# EAGLE design NixieClock (EAGLE 6.3)
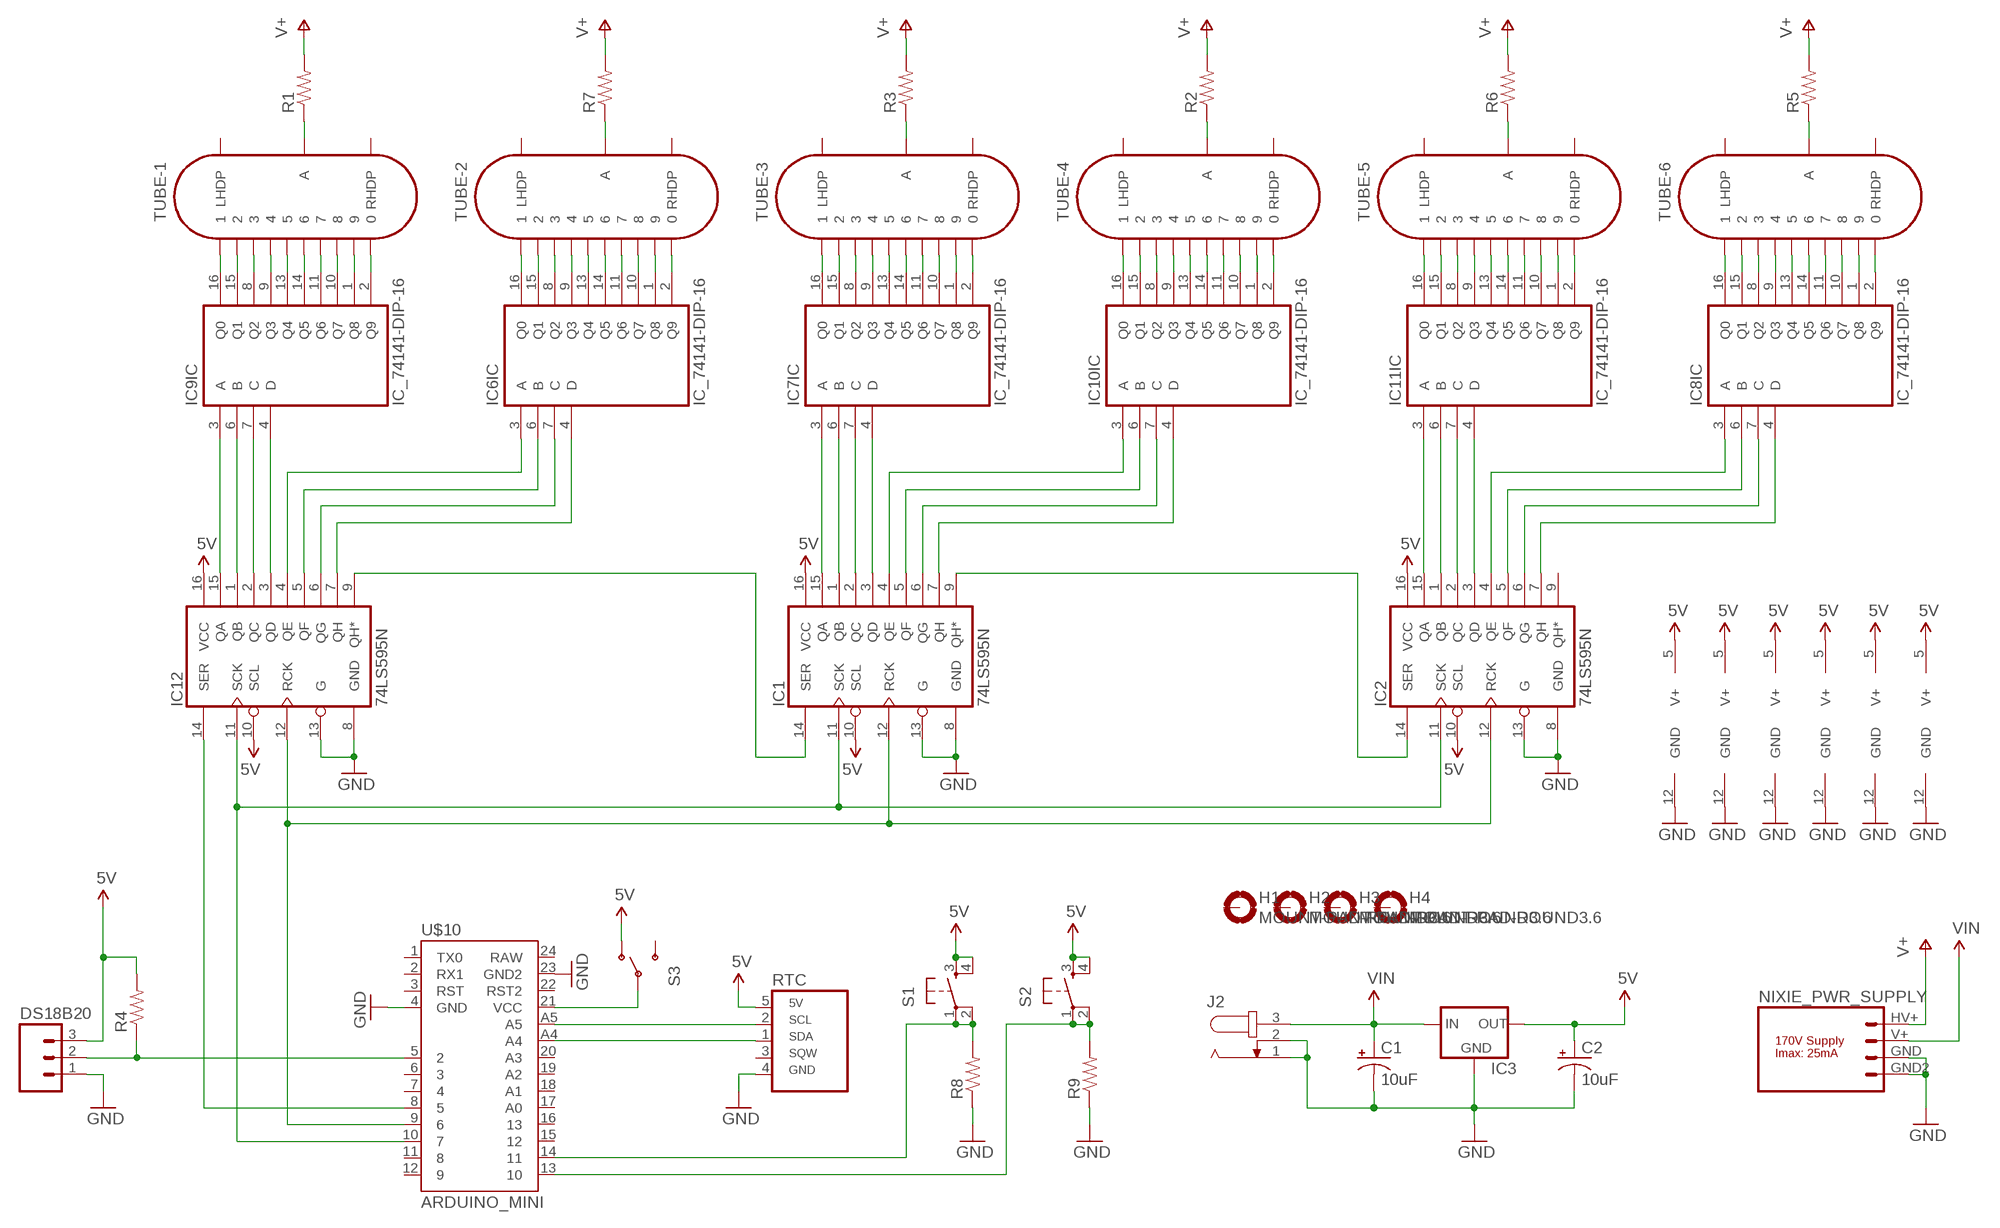
[diagram p0: schematic, sheet 1]

## Parts
C1  10uF  CAP_POLPTH2  [CPOL-RADIAL-10UF-25V]
C2  10uF  CAP_POLPTH2  [CPOL-RADIAL-10UF-25V]
DS18B20  DS18B20DS18B20  [DS18B20]
H1  MOUNT-PAD-ROUND3.6  [3,6-PAD]
H2  MOUNT-PAD-ROUND3.6  [3,6-PAD]
H3  MOUNT-PAD-ROUND3.6  [3,6-PAD]
H4  MOUNT-PAD-ROUND3.6  [3,6-PAD]
IC1  74LS595N  [DIL16]
IC2  74LS595N  [DIL16]
IC3  V_REG_78XXSIDE  [78XXL]
IC6  IC_74141-DIP-16  [DIL16]
IC7  IC_74141-DIP-16  [DIL16]
IC8  IC_74141-DIP-16  [DIL16]
IC9  IC_74141-DIP-16  [DIL16]
IC10  IC_74141-DIP-16  [DIL16]
IC11  IC_74141-DIP-16  [DIL16]
IC12  74LS595N  [DIL16]
J2  JACK-PLUG0  [SPC4077]
NIXIE_PWR_SUPPLY  NIXIE_PWR_SUPPLYPTH  [NIXIE_PWR_SUPPLY]
R1  RESISTORPTH-1/4W  [AXIAL-0.4]
R2  RESISTORPTH-1/4W  [AXIAL-0.4]
R3  RESISTORPTH-1/4W  [AXIAL-0.4]
R4  RESISTORPTH-1/4W  [AXIAL-0.4]
R5  RESISTORPTH-1/4W  [AXIAL-0.4]
R6  RESISTORPTH-1/4W  [AXIAL-0.4]
R7  RESISTORPTH-1/4W  [AXIAL-0.4]
R8  RESISTORPTH-1/4W  [AXIAL-0.4]
R9  RESISTORPTH-1/4W  [AXIAL-0.4]
RTC  SCOTT_RTCPTH  [SCOTT_RTC]
S1  TAC_SWITCHPTH  [TACTILE-PTH]
S2  TAC_SWITCHPTH  [TACTILE-PTH]
S3  SWITCH-SPDTPTH  [SWITCH-SPDT]
TUBE-1  IN-14  [IN-14]
TUBE-2  IN-14  [IN-14]
TUBE-3  IN-14  [IN-14]
TUBE-4  IN-14  [IN-14]
TUBE-5  IN-14  [IN-14]
TUBE-6  IN-14  [IN-14]
U$10  ARDUINO_MINI  [ARDUINO_MINI]

## Nets
5V: C2.1(+) DS18B20.3(5V) IC1.10(SCL) IC1.16(VCC) IC2.10(SCL) IC2.16(VCC) IC3.OUT IC6.5(SUPPLY:V+) IC7.5(SUPPLY:V+) IC8.5(SUPPLY:V+) IC9.5(SUPPLY:V+) IC10.5(SUPPLY:V+) IC11.5(SUPPLY:V+) IC12.10(SCL) IC12.16(VCC) R4.P$2 RTC.5(5V) S1.3 S1.4 S2.3 S2.4 S3.1(O)
GND: C1.2(-) C2.2(-) DS18B20.1(GND) IC1.8(GND) IC1.13(G) IC2.8(GND) IC2.13(G) IC3.GND IC6.12(SUPPLY:GND) IC7.12(SUPPLY:GND) IC8.12(SUPPLY:GND) IC9.12(SUPPLY:GND) IC10.12(SUPPLY:GND) IC11.12(SUPPLY:GND) IC12.8(GND) IC12.13(G) J2.1 J2.2 NIXIE_PWR_SUPPLY.GND NIXIE_PWR_SUPPLY.GND2 R8.P$1 R9.P$1 RTC.4(GND) U$10.4(GND) U$10.23(GND2)
N$1 [High Voltage 170V]: R1.P$1 TUBE-1.A
N$2 [High Voltage 170V]: R7.P$1 TUBE-2.A
N$3 [High Voltage 170V]: R3.P$1 TUBE-3.A
N$4 [High Voltage 170V]: R2.P$1 TUBE-4.A
N$5 [High Voltage 170V]: R6.P$1 TUBE-5.A
N$6 [High Voltage 170V]: R5.P$1 TUBE-6.A
N$7: IC9.16(IC:Q0) TUBE-1.1
N$8 [High Voltage 60V]: IC9.15(IC:Q1) TUBE-1.2
N$9 [High Voltage 60V]: IC9.8(IC:Q2) TUBE-1.3
N$10 [High Voltage 60V]: IC9.9(IC:Q3) TUBE-1.4
N$11 [High Voltage 60V]: IC9.13(IC:Q4) TUBE-1.5
N$12 [High Voltage 60V]: IC9.14(IC:Q5) TUBE-1.6
N$13 [High Voltage 60V]: IC9.11(IC:Q6) TUBE-1.7
N$14 [High Voltage 60V]: IC9.10(IC:Q7) TUBE-1.8
N$15 [High Voltage 60V]: IC9.1(IC:Q8) TUBE-1.9
N$16 [High Voltage 60V]: IC9.2(IC:Q9) TUBE-1.0
N$17 [High Voltage 60V]: IC6.16(IC:Q0) TUBE-2.1
N$18 [High Voltage 60V]: IC6.15(IC:Q1) TUBE-2.2
N$19 [High Voltage 60V]: IC6.8(IC:Q2) TUBE-2.3
N$20 [High Voltage 60V]: IC6.9(IC:Q3) TUBE-2.4
N$21 [High Voltage 60V]: IC6.13(IC:Q4) TUBE-2.5
N$22 [High Voltage 60V]: IC6.14(IC:Q5) TUBE-2.6
N$23 [High Voltage 60V]: IC6.11(IC:Q6) TUBE-2.7
N$24 [High Voltage 60V]: IC6.10(IC:Q7) TUBE-2.8
N$25 [High Voltage 60V]: IC6.1(IC:Q8) TUBE-2.9
N$26 [High Voltage 60V]: IC6.2(IC:Q9) TUBE-2.0
N$27 [High Voltage 60V]: IC7.16(IC:Q0) TUBE-3.1
N$28 [High Voltage 60V]: IC7.15(IC:Q1) TUBE-3.2
N$29 [High Voltage 60V]: IC7.8(IC:Q2) TUBE-3.3
N$30 [High Voltage 60V]: IC7.9(IC:Q3) TUBE-3.4
N$31 [High Voltage 60V]: IC7.13(IC:Q4) TUBE-3.5
N$32 [High Voltage 60V]: IC7.14(IC:Q5) TUBE-3.6
N$33 [High Voltage 60V]: IC7.11(IC:Q6) TUBE-3.7
N$34 [High Voltage 60V]: IC7.10(IC:Q7) TUBE-3.8
N$35 [High Voltage 60V]: IC7.1(IC:Q8) TUBE-3.9
N$36 [High Voltage 60V]: IC7.2(IC:Q9) TUBE-3.0
N$37 [High Voltage 60V]: IC10.16(IC:Q0) TUBE-4.1
N$38 [High Voltage 60V]: IC10.15(IC:Q1) TUBE-4.2
N$39 [High Voltage 60V]: IC10.8(IC:Q2) TUBE-4.3
N$40 [High Voltage 60V]: IC10.9(IC:Q3) TUBE-4.4
N$41 [High Voltage 60V]: IC10.13(IC:Q4) TUBE-4.5
N$42 [High Voltage 60V]: IC10.14(IC:Q5) TUBE-4.6
N$43 [High Voltage 60V]: IC10.11(IC:Q6) TUBE-4.7
N$44 [High Voltage 60V]: IC10.10(IC:Q7) TUBE-4.8
N$45 [High Voltage 60V]: IC10.1(IC:Q8) TUBE-4.9
N$46 [High Voltage 60V]: IC10.2(IC:Q9) TUBE-4.0
N$47 [High Voltage 60V]: IC11.16(IC:Q0) TUBE-5.1
N$48 [High Voltage 60V]: IC11.15(IC:Q1) TUBE-5.2
N$49 [High Voltage 60V]: IC11.8(IC:Q2) TUBE-5.3
N$50 [High Voltage 60V]: IC11.9(IC:Q3) TUBE-5.4
N$51 [High Voltage 60V]: IC11.13(IC:Q4) TUBE-5.5
N$52 [High Voltage 60V]: IC11.14(IC:Q5) TUBE-5.6
N$53 [High Voltage 60V]: IC11.11(IC:Q6) TUBE-5.7
N$54 [High Voltage 60V]: IC11.10(IC:Q7) TUBE-5.8
N$55 [High Voltage 60V]: IC11.1(IC:Q8) TUBE-5.9
N$56 [High Voltage 60V]: IC11.2(IC:Q9) TUBE-5.0
N$57 [High Voltage 60V]: IC8.16(IC:Q0) TUBE-6.1
N$58 [High Voltage 60V]: IC8.15(IC:Q1) TUBE-6.2
N$59 [High Voltage 60V]: IC8.8(IC:Q2) TUBE-6.3
N$60 [High Voltage 60V]: IC8.9(IC:Q3) TUBE-6.4
N$61 [High Voltage 60V]: IC8.13(IC:Q4) TUBE-6.5
N$62 [High Voltage 60V]: IC8.14(IC:Q5) TUBE-6.6
N$63 [High Voltage 60V]: IC8.11(IC:Q6) TUBE-6.7
N$64 [High Voltage 60V]: IC8.10(IC:Q7) TUBE-6.8
N$65 [High Voltage 60V]: IC8.1(IC:Q8) TUBE-6.9
N$66 [High Voltage 60V]: IC8.2(IC:Q9) TUBE-6.0
N$67: IC1.1(QB) IC7.6(IC:B)
N$68: IC1.2(QC) IC7.7(IC:C)
N$69: IC1.3(QD) IC7.4(IC:D)
N$70: IC1.15(QA) IC7.3(IC:A)
N$71: IC9.6(IC:B) IC12.1(QB)
N$72: IC9.7(IC:C) IC12.2(QC)
N$73: IC9.4(IC:D) IC12.3(QD)
N$74: IC9.3(IC:A) IC12.15(QA)
N$75: IC2.1(QB) IC11.6(IC:B)
N$76: IC2.2(QC) IC11.7(IC:C)
N$77: IC2.3(QD) IC11.4(IC:D)
N$78: IC2.15(QA) IC11.3(IC:A)
N$79: IC6.3(IC:A) IC12.4(QE)
N$80: IC6.6(IC:B) IC12.5(QF)
N$81: IC6.7(IC:C) IC12.6(QG)
N$82: IC6.4(IC:D) IC12.7(QH)
N$83: IC1.14(SER) IC12.9(QH*)
N$84: IC1.9(QH*) IC2.14(SER)
N$85: IC1.4(QE) IC10.3(IC:A)
N$86: IC1.5(QF) IC10.6(IC:B)
N$87: IC1.6(QG) IC10.7(IC:C)
N$88: IC1.7(QH) IC10.4(IC:D)
N$89: IC12.14(SER) U$10.8
N$90: IC2.4(QE) IC8.3(IC:A)
N$91: IC2.5(QF) IC8.6(IC:B)
N$92: IC2.6(QG) IC8.7(IC:C)
N$93: IC2.7(QH) IC8.4(IC:D)
N$94: IC1.11(SCK) IC2.11(SCK) IC12.11(SCK) U$10.10
N$95: IC1.12(RCK) IC2.12(RCK) IC12.12(RCK) U$10.9
N$96: R9.P$2 S2.1 S2.2 U$10.13
N$97: DS18B20.2(DS) R4.P$1 U$10.5
N$98: RTC.2(SCL) U$10.A5
N$99: RTC.1(SDA) U$10.A4
N$100: S3.2(P) U$10.21(VCC)
N$101: R8.P$2 S1.1 S1.2 U$10.14
V+ [High Voltage 170V]: NIXIE_PWR_SUPPLY.HV+ R1.P$2 R2.P$2 R3.P$2 R5.P$2 R6.P$2 R7.P$2
VIN: C1.1(+) IC3.IN J2.3 NIXIE_PWR_SUPPLY.V+
Unconnected: H1.B3,6(MOUNT) H2.B3,6(MOUNT) H3.B3,6(MOUNT) H4.B3,6(MOUNT) IC2.9(QH*) RTC.3(SQW) S3.3(S) TUBE-1.LHDP TUBE-1.RHDP TUBE-2.LHDP TUBE-2.RHDP TUBE-3.LHDP TUBE-3.RHDP TUBE-4.LHDP TUBE-4.RHDP TUBE-5.LHDP TUBE-5.RHDP TUBE-6.LHDP TUBE-6.RHDP U$10.1(TX0) U$10.2(RX1) U$10.3(RST) U$10.6 U$10.7 U$10.11 U$10.12 U$10.15 U$10.16 U$10.17(A0) U$10.18(A1) U$10.19(A2) U$10.20(A3) U$10.22(RST2) U$10.24(RAW)

## Library data of the parts
C1 C2 = SparkFun-Passives:CAP_POL: Capacitor Polarized These are standard SMD and PTH capacitors. Normally 10uF, 47uF, and 100uF in electrolytic and tantalum varieties. Always verify the external diameter of the through hole cap, it varies with capacity, voltage, and manufacturer. The EIA devices should be standard.
DS18B20 = ScottCustom:DS18B20: Header 3 Standard 3-pin 0.1" header. Use with straight break away headers (SKU : PRT-00116), right angle break away headers (PRT-00553), swiss pins (PRT-00743), machine pins (PRT-00117), and female headers (PRT-00115). Molex polarized connector foot print use with SKU : PRT-08232 with associated crimp pins and housings.
H1-H4 = holes:MOUNT-PAD-ROUND: MOUNTING PAD, round
IC1 IC2 IC12 = SparkFun:74*595: 8-bit SHIFT REGISTER, output latch
IC3 = SparkFun:V_REG_78XX: Voltage Regulator Standard 7805 5V regulator. IGO (Input Ground Output). Spark Fun Electronics SKU : COM-00107
IC6-IC11 = dp_devices:IC_74141: BCD to decimal decoder
J2 = con-jack:JACK-PLUG: DC POWER JACK Power Jack, DC, Right Angle, Through Hole, Rated 5A at 16VDC, PC Terminals Distributor: Farnell (www.Farnell.de) Drawing: 84N1161.pdf / 84N1162.pdf Manufacturer: SPC Technology (www.spctechnology.com) Type: SPC4077 / SPC 4078; OC_FARNELL: unknown; OC_NEWARK: unknown
NIXIE_PWR_SUPPLY = ScottCustom:NIXIE_PWR_SUPPLY: Header 4 Standard 4-pin 0.1" header. Use with straight break away headers (SKU : PRT-00116), right angle break away headers (PRT-00553), swiss pins (PRT-00743), machine pins (PRT-00117), and female headers (PRT-00115). Molex polarized connector foot print use with SKU : PRT-08231 with associated crimp pins and housings. 1MM SMD Version SKU: PRT-10208
R1-R3 R5-R7 = SparkFun:RESISTOR: Resistor Basic schematic elements and footprints for 0603, 1206, and PTH resistors.
R4 R8 R9 = SparkFun-Passives:RESISTOR: Resistor Basic schematic elements and footprints for 0603, 1206, and PTH resistors.
RTC = ScottCustom:SCOTT_RTC: Sparkfun RTC breakout board. 5-pin PTH connector.
S1 S2 = SparkFun-Electromechanical:TAC_SWITCH: Momentary Switch Button commonly used for reset or general input. Spark Fun Electronics SKU : COM-00097 SMT- SWCH-08247
S3 = SparkFun-Electromechanical:SWITCH-SPDT: SPDT Switch Simple slide switch, Spark Fun Electronics SKU : COM-00102 DPDT SMT slide switch, AYZ0202, SWCH-08179
TUBE-1-TUBE-6 = ScottCustom:IN-14: IN-14: medium numeric frontview nixie tube
U$10 = ScottCustom:ARDUINO_MINI: Arduino Pro Mini footprint

## Net classes
0 default: width 0.305 mm, clearance 0.305 mm
1 High Voltage 170V: width 0.61 mm, clearance 0.61 mm
2 High Voltage 60V: width 0.406 mm, clearance 0.406 mm
3 Power GND: width 1.016 mm, clearance 0.406 mm

## Board
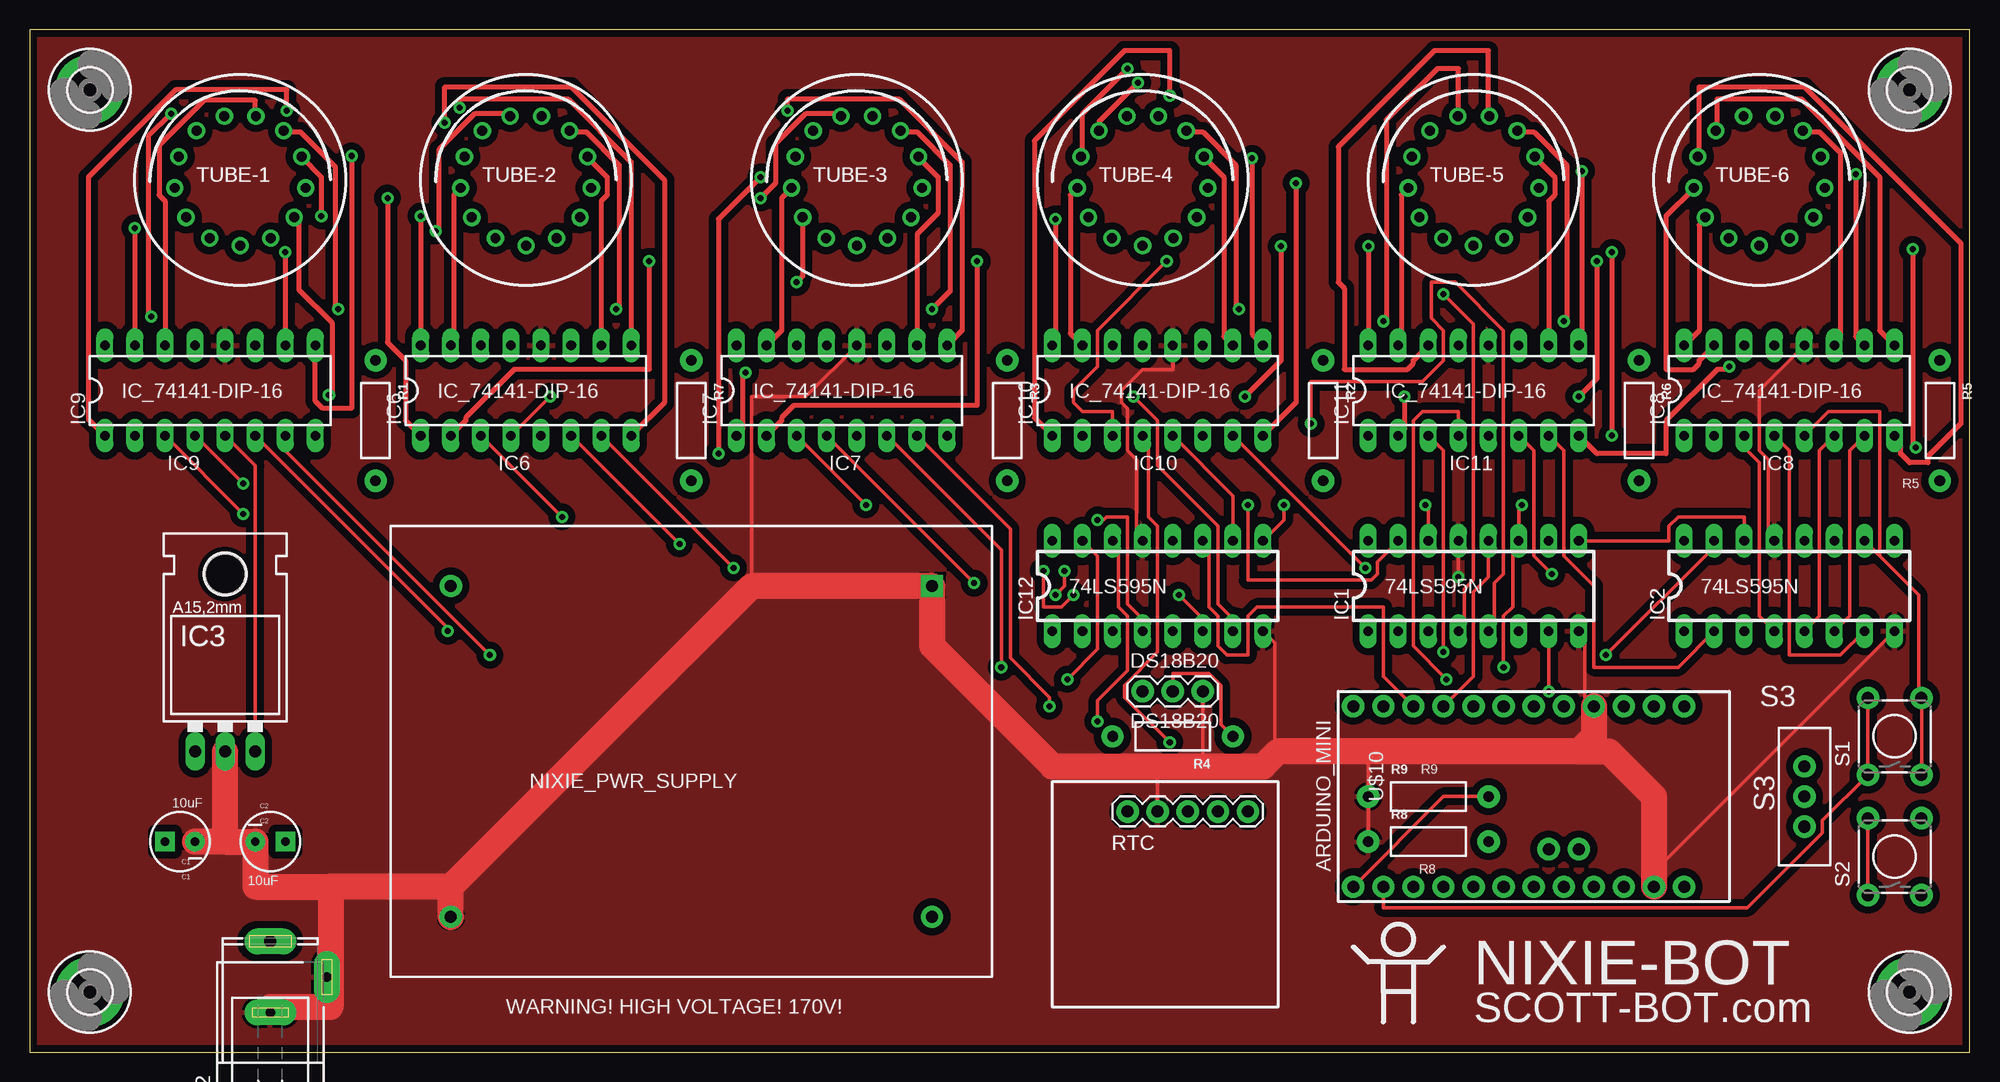
[diagram p1: board, top side]
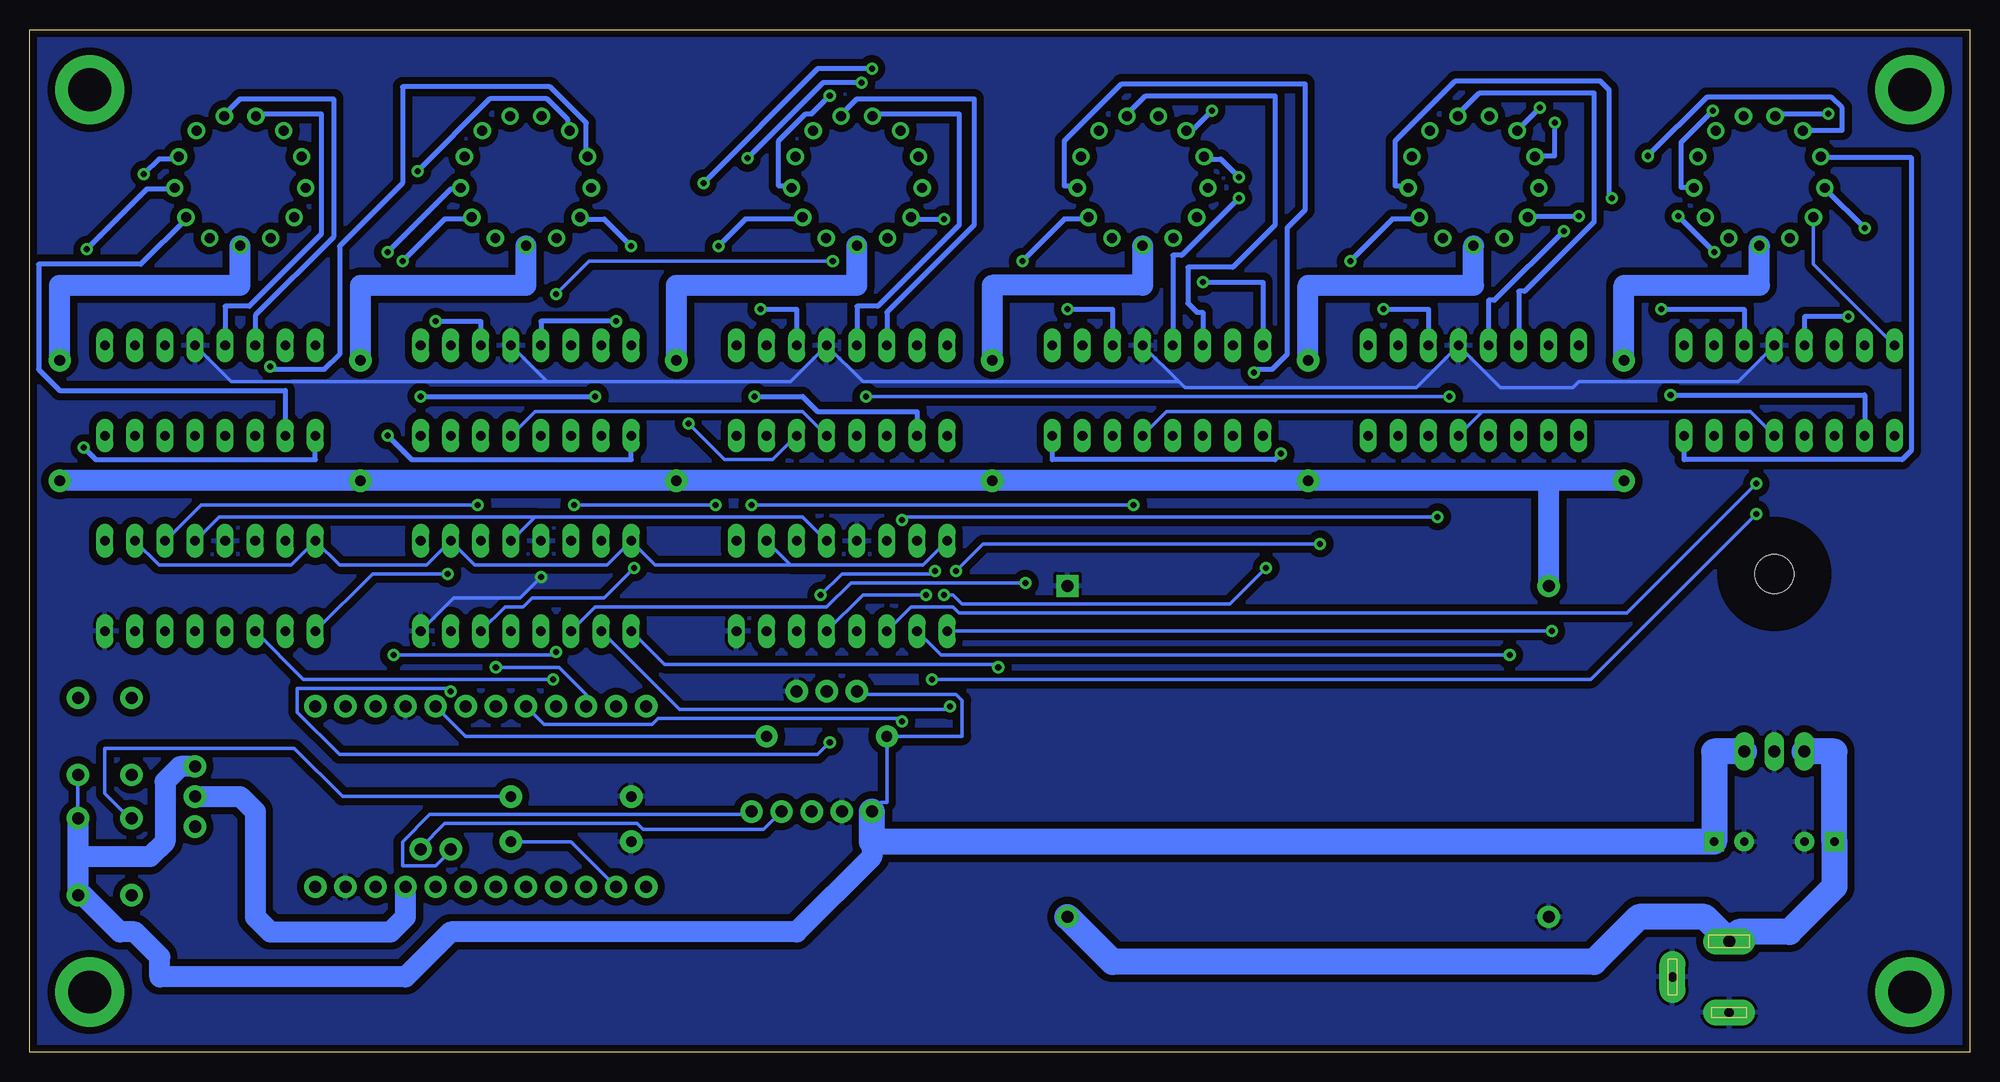
[diagram p2: board, bottom side, seen from below]

Size 163.83 x 86.36 mm. Coordinates in mm from the lower left corner, seen from the top.
Outline: 0,0 163.81,0 163.83,86.36 0,86.36 0,0
Copper layers (1*16): Top 0.035mm / dielectric 1.5mm / Bottom 0.035mm
Design rules "SparkFun": minimum track width 8mil, minimum drill 20mil, track to track 8mil, track to pad 8mil, pad to pad 8mil, via to via 8mil, smd to smd 8mil, copper to edge 10mil, drill to drill 8mil, minimum pad ring 12mil, minimum via ring 10mil, stop-mask expansion 4mil, vias tented up to drill 25mil, thermal gap 10mil

### Footprints (pad centres in the part's own frame; a part is rotated, then mirrored left to right if it is on the bottom)
CPOL-RADIAL-10UF-25V = drill 0.7 pad 1.651 square: 1 1.27,0 | drill 0.7 pad 1.651: 2 -1.27,0
DS18B20 = drill 1.016 pad 1.88: 1 0,0; 2 2.54,0; 3 5.08,0
3,6-PAD = drill 3.6 pad 5.842: B3,6 0,0
DIL16 = drill 0.813 long: 1 -8.89,-3.81; 2 -6.35,-3.81; 3 -3.81,-3.81; 4 -1.27,-3.81; 5 1.27,-3.81; 6 3.81,-3.81; 7 6.35,-3.81; 8 8.89,-3.81; 9 8.89,3.81; 10 6.35,3.81; 11 3.81,3.81; 12 1.27,3.81; 13 -1.27,3.81; 14 -3.81,3.81; 15 -6.35,3.81; 16 -8.89,3.81
78XXL = drill 1.016 long: GND 0,-3.81; IN -2.54,-3.81; OUT 2.54,-3.81 | hole 3.302: 0,11.176
SPC4077 = drill 0.8 pad 2.184 long: 1 -3,0; 2 0,-4.8 | drill 1 pad 2.184 long: 3 3,0
NIXIE_PWR_SUPPLY = drill 1.016 pad 1.88: GND 21.59,17.78; HV+ 21.59,-10.16; V+ -19.05,17.78 | drill 1.016 pad 1.88 square: GND2 -19.05,-10.16
AXIAL-0.4 = drill 0.9 pad 1.88: P$1 -5.08,0; P$2 5.08,0
SCOTT_RTC = drill 1.016 pad 1.88: 1 7.62,7.62; 2 5.08,7.62; 3 2.54,7.62; 4 0,7.62; 5 -2.54,7.62
TACTILE-PTH = drill 1.016 pad 1.88: 1 -3.251,2.261; 2 3.251,2.261; 3 -3.251,-2.261; 4 3.251,-2.261
SWITCH-SPDT = drill 1.016 pad 1.88: 1 0,2.54; 2 0,0; 3 0,-2.54
IN-14 = drill 0.84: 0 4.572,-3.157; 1 -4.572,-3.157; 2 -5.517,-0.671; 3 -5.194,1.971; 4 -3.686,4.158; 5 -1.331,5.395; 6 1.331,5.395; 7 3.686,4.158; 8 5.194,1.971; 9 5.517,-0.671; A 0,-5.558; LHDP 2.583,-4.92; RHDP -2.583,-4.92
ARDUINO_MINI = drill 1.016 pad 1.88: 1 -7.62,12.7; 2 -7.62,10.16; 3 -7.62,7.62; 4 -7.62,5.08; 5 -7.62,2.54; 6 -7.62,0; 7 -7.62,-2.54; 8 -7.62,-5.08; 9 -7.62,-7.62; 10 -7.62,-10.16; 11 -7.62,-12.7; 12 -7.62,-15.24; 13 7.62,-15.24; 14 7.62,-12.7; 15 7.62,-10.16; 16 7.62,-7.62; 17 7.62,-5.08; 18 7.62,-2.54; 19 7.62,0; 20 7.62,2.54; 21 7.62,5.08; 22 7.62,7.62; 23 7.62,10.16; 24 7.62,12.7; A4 4.445,1.27; A5 4.445,3.81

### Placement (x,y rotation side)
C1  12.7,17.78 180 top
C2  20.32,17.78 0 top
DS18B20  99.06,30.48 180 top
H1  5.08,5.08 0 top
H2  158.75,5.08 0 top
H3  158.75,81.28 0 top
H4  5.08,81.28 0 top
IC1  121.92,39.37 0 top
IC2  148.59,39.37 0 top
IC3  16.51,29.21 0 top
IC6  41.91,55.88 0 top
IC7  68.58,55.88 0 top
IC8  148.59,55.88 0 top
IC9  15.24,55.88 0 top
IC10  95.25,55.88 0 top
IC11  121.92,55.88 0 top
IC12  95.25,39.37 0 top
J2  20.32,6.35 90 top
NIXIE_PWR_SUPPLY  57.15,29.21 180 top
R1  29.21,53.34 270 top
R2  109.22,53.34 270 top
R3  82.55,53.34 270 top
R4  96.52,26.67 180 top
R5  161.29,53.34 270 top
R6  135.89,53.34 270 top
R7  55.88,53.34 270 top
R8  118.11,17.78 0 top
R9  118.11,21.59 0 top
RTC  95.25,12.7 0 top
S1  157.48,26.67 90 top
S2  157.48,16.51 90 top
S3  149.86,21.59 0 top
TUBE-1  17.78,73.66 0 top
TUBE-2  41.91,73.66 0 top
TUBE-3  69.85,73.66 0 top
TUBE-4  93.98,73.66 0 top
TUBE-5  121.92,73.66 0 top
TUBE-6  146.05,73.66 0 top
U$10  127,21.59 270 top

### Tracks (layer width: path | path; a pad name or v marks a point on that pad's centre or on a via)
5V
  Top 0.305: IC10.5 101.6,46.99 IC12.10 | 156.21,41.91 159.51,38.61 159.51,29.97 S1.4 159.77,29.72 159.77,23.62 S1.3 | 156.21,41.91 IC2.10 | IC8.5 151.89,54.1 156.21,54.1 156.21,41.91 | IC9.5 19.05,49.53 IC3.OUT
  Bottom 0.305: IC12.16 88.39,41.15 99.57,41.15 | IC12.10 99.57,41.15 | 99.57,41.15 111,41.15 IC1.16 115.06,41.15 126.24,41.15 IC1.10 130.3,41.15 137.67,41.15 IC2.16 141.73,41.15 152.91,41.15 IC2.10 | IC11.5 121.16,54.1 98.55,54.1 IC10.5 | 41.15,54.1 IC6.5 | 41.15,54.1 18.54,54.1 IC9.5 | IC7.5 67.82,54.1 41.15,54.1 | RTC.5 91.95,21.08 91.44,21.08 R4.P$2 85.09,26.67 85.09,29.72 85.6,30.23 93.73,30.23 DS18B20.3 | S1.3 159.77,23.37 159.77,20.57 S2.4
  Bottom 1.778: RTC.5 92.71,16.51 99.06,10.16 128.27,10.16 132.08,6.35 152.83,6.35 152.83,8.05 154.94,10.16 156.21,10.16 159.31,13.26 S2.3 159.74,16.51 | 159.74,16.51 S2.4 | S3.1 151.13,24.13 152.4,22.86 152.4,17.78 153.67,16.51 159.74,16.51
  Bottom 2.184: IC3.OUT 21.59,25.4 C2.1 92.71,17.78 RTC.5
GND  (via drill 0.51)
  Top 0.305: IC2.13 146.81,43.69 146.81,50.04 146.05,50.8 146.05,55.88 IC8.12 | IC12.13 93.47,43.69 93.47,50.04 92.71,50.8 92.71,54.36 92.2,54.86 92.2,55.88 93.98,57.66 96.52,57.66 IC10.12 | R8.P$1 R9.P$1 113.03,25.4 | IC12.8 105.16,34.54 105.16,26.42 105.41,25.4 | IC1.8 131.32,35.05 131.32,29.97 U$10.4 | v120.65,40.13 IC1.13 | IC2.8 138.18,16.26 137.16,16.26 | IC7.12 65.53,55.37 60.96,55.37 60.96,39.37 | 95.25,24.13 RTC.4 | 99.06,24.13 DS18B20.1 | 20.32,3.3 J2.1 20.32,3.81 | J2.2 25.4,6.35
  Top 2.184: 25.4,13.97 19.05,13.97 C2.2 16.51,17.78 | 25.4,13.97 25.4,6.35 25.4,3.81 20.32,3.81 | 16.51,17.78 IC3.GND | NIXIE_PWR_SUPPLY.GND 35.56,13.97 | 35.56,13.97 25.4,13.97 | 35.56,13.97 60.96,39.37 NIXIE_PWR_SUPPLY.GND2 76.2,34.29 86.36,24.13 95.25,24.13 99.06,24.13 104.14,24.13 105.41,25.4 113.03,25.4 130.81,25.4 | U$10.4 132.08,26.67 130.81,25.4 | 130.81,25.4 133.35,25.4 137.16,21.59 137.16,16.26 U$10.23 | 16.51,17.78 C1.2
  Bottom 0.305: 120.14,56.64 IC11.12 | 120.14,56.64 99.57,56.64 IC10.12 93.47,56.64 66.8,56.64 | IC8.12 146.81,56.64 120.14,56.64 | IC9.12 19.56,56.64 33.02,56.64 33.53,56.13 39.62,56.13 IC6.12 46.74,56.13 66.29,56.13 66.8,56.64 | v120.65,40.13 122.43,38.35 128.02,38.35 IC1.8 | IC7.12 66.8,56.64
  pour Bottom (isolate 0.61): 0,86.36 163.83,86.36 163.83,0 0,0
  pour Top (isolate 0.61): 0,86.36 163.83,86.36 163.83,0 0,0
N$1
  Bottom 1.778: R1.P$1 29.21,64.77 17.78,64.77 TUBE-1.A
N$2
  Bottom 1.778: R7.P$1 55.88,64.77 41.91,64.77 TUBE-2.A
N$3
  Bottom 1.778: TUBE-3.A 69.85,64.77 82.55,64.77 R3.P$1
N$4
  Bottom 1.778: R2.P$1 109.22,64.77 93.98,64.77 TUBE-4.A
N$5
  Bottom 1.778: R6.P$1 135.89,64.77 121.92,64.77 TUBE-5.A
N$6
  Bottom 1.778: R5.P$1 161.29,64.77 146.05,64.77 TUBE-6.A
N$7
  Bottom 0.305: IC9.16 13.21,66.55 TUBE-1.1
N$8  (via drill 0.51)
  Top 0.406: v8.89,69.6 IC9.15
  Bottom 0.406: v8.89,69.6 12.19,72.9 TUBE-1.2
N$9
  Bottom 0.406: IC9.8 24.13,50.04 5.71,50.04 4.95,50.8 4.95,75.56 12.57,75.56 TUBE-1.3
N$10  (via drill 0.51)
  Top 0.406: IC9.9 24.13,54.99 24.77,54.36 27.18,54.36 v27.18,75.69
  Bottom 0.406: v27.18,75.69 22.23,80.64 11.68,80.64 10.79,79.76 10.79,77.85 13.97,77.85 TUBE-1.4
N$11  (via drill 0.51)
  Top 0.406: v10.29,62.1 10.03,62.36 10.03,77.34 v11.94,79.25
  Bottom 0.406: IC9.13 13.97,62.1 v10.29,62.1 | v11.94,79.25 16.26,79.25 TUBE-1.5
N$12
  Top 0.406: IC9.14 11.43,71.88 10.92,72.39 10.92,76.58 14.73,80.39 19.05,80.39 19.05,79.12 TUBE-1.6
N$13  (via drill 0.51)
  Top 0.406: v26.04,62.74 25.78,62.99 25.78,74.8 22.86,77.72 21.59,77.72 TUBE-1.7
  Bottom 0.406: IC9.11 19.05,62.74 v26.04,62.74
N$14  (via drill 0.51)
  Top 0.406: v21.59,67.56 IC9.10 | v24.64,70.61 24.64,73.91 22.99,75.56 TUBE-1.8
  Bottom 0.406: v24.64,70.61 v21.59,67.56
N$15  (via drill 0.51)
  Top 0.406: IC9.1 4.95,53.47 4.95,73.91 12.32,81.28 21.72,81.28 v21.72,79.5
  Bottom 0.406: v21.72,79.5 24.38,76.83 24.38,73.03 23.37,73.03 TUBE-1.9
N$16  (via drill 0.51)
  Top 0.406: v25.27,55.5 25.53,55.75 25.53,61.59 22.73,64.39 22.73,70.1 22.35,70.48 TUBE-1.0
  Bottom 0.406: IC9.2 8.89,55.5 v25.27,55.5
N$17  (via drill 0.51)
  Top 0.406: v33.02,70.61 IC6.16
  Bottom 0.406: v33.02,70.61 37.34,70.61 TUBE-2.1
N$18
  Top 0.406: IC6.15 35.81,59.94 35.81,72.39 36.32,72.9 TUBE-2.2
N$19  (via drill 0.51)
  Top 0.406: IC6.8 53.59,54.86 53.59,73.66 45.72,81.53 35.05,81.53 v35.05,78.49
  Bottom 0.406: v35.05,78.49 35.05,75.69 36.58,75.69 TUBE-2.3
N$20  (via drill 0.51)
  Top 0.406: IC6.9 50.8,75.18 45.47,80.52 36.32,80.52 v36.32,79.76
  Bottom 0.406: v36.32,79.76 38.1,77.98 TUBE-2.4
N$21  (via drill 0.51)
  Top 0.406: v34.29,69.34 34.54,69.6 34.54,76.2 37.59,79.25 40.39,79.25 TUBE-2.5
  Bottom 0.406: IC6.13 40.64,63.5 40.13,63.5 v34.29,69.34
N$22
  Bottom 0.406: IC6.14 38.1,64.26 37.59,64.26 31.75,70.1 31.75,81.03 41.4,81.03 43.18,79.25 TUBE-2.6
N$23  (via drill 0.51)
  Top 0.406: v49.53,62.74 49.78,62.99 49.78,74.93 46.99,77.72 45.72,77.72 TUBE-2.7
  Bottom 0.406: IC6.11 45.72,62.74 v49.53,62.74
N$24
  Top 0.406: IC6.10 48.26,71.88 48.77,72.39 48.77,73.91 47.24,75.44 TUBE-2.8
N$25  (via drill 0.51)
  Top 0.406: v30.23,72.14 30.23,59.94 31.75,58.42 31.75,53.34 IC6.1
  Bottom 0.406: TUBE-2.9 47.5,73.15 48.51,73.15 48.51,76.96 43.43,82.04 31.24,82.04 30.48,81.28 30.48,72.39 v30.23,72.14
N$26  (via drill 0.51)
  Top 0.406: IC6.2 36.83,53.34 36.83,53.59 40.89,57.66 52.32,57.66 v52.32,66.8
  Bottom 0.406: v52.32,66.8 48.77,70.36 46.48,70.36 TUBE-2.0
N$27  (via drill 0.51)
  Top 0.406: v64.77,65.02 65.28,65.53 TUBE-3.1
  Bottom 0.406: IC7.16 59.69,65.02 v64.77,65.02
N$28
  Top 0.406: IC7.15 63.5,60.96 63.5,72.14 64.26,72.9 TUBE-3.2
N$29  (via drill 0.51)
  Top 0.406: v58.17,50.55 58.17,70.36 v61.72,73.91
  Bottom 0.406: IC7.8 77.47,50.04 58.67,50.04 v58.17,50.55 | v61.72,73.91 63.25,75.44 64.52,75.44 TUBE-3.3
N$30  (via drill 0.51)
  Top 0.406: IC7.9 78.74,60.96 78.74,75.18 73.41,80.52 64.01,80.52 v64.01,79.5
  Bottom 0.406: v64.01,79.5 65.53,77.98 66.04,77.98 TUBE-3.4
N$31  (via drill 0.51)
  Top 0.406: v61.72,72.14 62.99,73.41 62.99,76.71 65.53,79.25 68.33,79.25 TUBE-3.5
  Bottom 0.406: IC7.13 67.31,67.31 66.55,67.31 v61.72,72.14
N$32
  Bottom 0.406: IC7.14 64.77,62.48 65.28,62.48 66.04,63.25 66.04,66.29 62.23,66.29 58.67,69.85 58.67,80.77 69.6,80.77 71.12,79.25 TUBE-3.6
N$33  (via drill 0.51)
  Top 0.406: v76.2,62.74 77.72,64.26 77.72,74.93 74.93,77.72 73.66,77.72 TUBE-3.7
  Bottom 0.406: IC7.11 72.39,62.74 v76.2,62.74
N$34
  Top 0.406: IC7.10 74.93,69.09 76.71,70.87 76.71,73.91 75.18,75.44 TUBE-3.8
N$35  (via drill 0.51)
  Top 0.406: IC7.1 60.2,52.58 60.2,57.15 v60.45,57.4
  Bottom 0.406: v60.45,57.4 60.2,57.66 58.93,57.66 57.66,58.93 57.66,69.6 56.13,71.12 56.13,81.79 71.63,81.79 76.45,76.96 76.45,73.15 75.44,73.15 TUBE-3.9
N$36  (via drill 0.51)
  Top 0.406: IC7.2 63.5,53.34 63.5,53.59 64.52,54.61 80.01,54.61 v80.01,66.8
  Bottom 0.406: v80.01,66.8 76.45,70.36 74.42,70.36 TUBE-3.0
N$37  (via drill 0.51)
  Top 0.406: IC10.16 86.61,59.94 v86.61,70.36
  Bottom 0.406: v86.61,70.36 89.41,70.36 TUBE-4.1
N$38
  Top 0.406: IC10.15 87.88,60.71 87.88,72.39 88.39,72.9 TUBE-4.2
N$39  (via drill 0.51)
  Top 0.406: IC10.8 106.93,54.86 v106.93,73.41 | v92.71,83.06 88.9,79.25 88.9,75.69 TUBE-4.3
  Bottom 0.406: v106.93,73.41 97.28,83.06 v92.71,83.06
N$40  (via drill 0.51)
  Top 0.406: v103.23,75.49 103.23,60.66 104.14,59.74 IC10.9 | v93.57,81.89 90.32,78.64 90.32,77.83 TUBE-4.4
  Bottom 0.406: v103.23,75.49 96.83,81.89 v93.57,81.89
N$41
  Bottom 0.406: IC10.13 93.98,62.99 92.2,62.99 85.34,69.85 85.34,79.25 92.46,79.25 TUBE-4.5
N$42
  Bottom 0.406: IC10.14 91.44,62.48 84.07,69.85 84.07,80.52 93.98,80.52 95.25,79.25 TUBE-4.6
N$43  (via drill 0.51)
  Top 0.406: v102.11,62.74 101.85,62.99 101.85,74.93 99.06,77.72 97.79,77.72 TUBE-4.7
  Bottom 0.406: IC10.11 99.06,62.74 v102.11,62.74
N$44
  Top 0.406: IC10.10 100.84,60.45 100.84,73.91 99.31,75.44 TUBE-4.8
N$45  (via drill 0.51)
  Top 0.406: IC10.1 84.84,53.59 84.84,76.96 92.46,84.58 96.27,84.58 v96.27,80.77
  Bottom 0.406: v96.27,80.77 97.79,79.25 98.3,79.25 100.58,76.96 100.58,73.15 99.57,73.15 TUBE-4.9
N$46  (via drill 0.51)
  Top 0.406: v102.62,55.37 105.66,58.42 v105.66,68.07
  Bottom 0.406: IC10.2 88.9,54.1 97.28,54.1 98.55,55.37 v102.62,55.37 | v105.66,68.07 103.38,70.36 98.55,70.36 TUBE-4.0
N$47  (via drill 0.51)
  Top 0.406: v113.03,68.07 IC11.16
  Bottom 0.406: v113.03,68.07 115.32,70.36 117.35,70.36 TUBE-5.1
N$48
  Top 0.406: IC11.15 115.82,59.94 115.82,72.39 116.33,72.9 TUBE-5.2
N$49  (via drill 0.51)
  Top 0.406: IC11.8 132.33,50.55 138.18,50.55 138.18,53.34 142.49,57.66 143.51,57.66 v143.51,57.91
  Bottom 0.406: v143.51,57.91 143.26,57.66 138.94,57.66 137.67,58.93 137.67,68.07 132.33,73.41 132.33,81.53 119.89,81.53 116.84,78.49 116.84,75.69 TUBE-5.3
N$50  (via drill 0.51)
  Top 0.406: IC11.9 131.06,59.94 v131.06,74.42
  Bottom 0.406: v131.06,74.42 124.97,80.52 120.14,80.52 118.36,78.74 118.36,77.98 TUBE-5.4
N$51  (via drill 0.51)
  Top 0.406: v114.3,61.72 114.55,61.98 114.55,78.74 118.87,83.06 120.65,83.06 120.65,79.25 TUBE-5.5
  Bottom 0.406: IC11.13 120.65,61.72 v114.3,61.72
N$52
  Top 0.406: IC11.14 116.84,58.42 116.84,58.17 116.33,57.66 111,57.66 111,64.52 110.49,65.02 110.49,76.45 118.62,84.58 123.19,84.58 123.19,79.25 TUBE-5.6
N$53  (via drill 0.51)
  Top 0.406: v129.54,61.72 129.79,61.98 129.79,74.93 127,77.72 125.73,77.72 TUBE-5.7
  Bottom 0.406: IC11.11 125.73,61.72 v129.54,61.72
N$54
  Top 0.406: IC11.10 128.27,71.88 128.78,72.39 128.78,73.91 127.25,75.44 TUBE-5.8
N$55  (via drill 0.51)
  Top 0.406: v133.6,67.56 v133.6,52.07
  Bottom 0.406: IC11.1 113.03,50.04 131.57,50.04 v133.6,52.07 | v133.6,67.56 128.27,72.9 127.51,72.9 TUBE-5.9
N$56  (via drill 0.51)
  Top 0.406: IC11.2 116.08,52.58 v116.08,55.37 | v130.81,55.37 132.33,56.9 v132.33,66.8
  Bottom 0.406: v130.81,55.37 v116.08,55.37 | v132.33,66.8 128.78,70.36 126.49,70.36 TUBE-5.0
N$57
  Top 0.406: IC8.16 140.97,60.96 140.97,69.85 141.48,70.36 TUBE-6.1
N$58
  Top 0.406: IC8.15 140.97,58.42 140.97,58.17 140.46,57.66 138.18,57.66 138.18,70.61 140.46,72.9 TUBE-6.2
N$59
  Top 0.406: IC8.8 157.99,51.56 157.99,50.55 158.75,49.78 160.27,49.78 160.27,50.29 163.07,53.09 163.07,68.33 149.86,81.53 140.97,81.53 140.97,75.69 TUBE-6.3
N$60
  Top 0.406: IC8.9 156.21,60.96 156.21,73.91 149.61,80.52 142.49,80.52 142.49,77.98 TUBE-6.4
N$61
  Bottom 0.406: IC8.13 147.32,62.99 145.29,62.99 139.19,69.09 139.19,79.25 144.53,79.25 TUBE-6.5
N$62
  Bottom 0.406: IC8.14 144.78,62.23 138.18,68.83 138.18,80.52 146.05,80.52 147.32,79.25 TUBE-6.6
N$63
  Top 0.406: IC8.11 152.91,60.2 152.91,75.95 151.13,77.72 149.86,77.72 TUBE-6.7
N$64  (via drill 0.51)
  Top 0.406: IC8.10 154.18,60.45 v154.18,74.17
  Bottom 0.406: v154.18,74.17 152.91,75.44 151.38,75.44 TUBE-6.8
N$65  (via drill 0.51)
  Top 0.406: v159.26,51.05 159,51.31 v159,67.82
  Bottom 0.406: IC8.1 139.7,50.04 158.24,50.04 v159.26,51.05 | v159,67.82 153.92,72.9 151.64,72.9 TUBE-6.9
N$66
  Bottom 0.406: IC8.2 142.24,55.88 161.29,55.88 163.07,57.66 163.07,66.55 154.43,66.55 150.62,70.36 TUBE-6.0
N$67  (via drill 0.51)
  Top 0.305: IC7.6 82.04,42.42 v82.04,32.51
  Bottom 0.305: v82.04,32.51 82.3,32.77 110.24,32.77 IC1.1
N$68  (via drill 0.51)
  Top 0.305: IC7.7 82.8,44.2 82.8,33.27 86.11,29.97 v86.11,29.21
  Bottom 0.305: v86.11,29.21 86.36,28.96 108.97,28.96 IC1.2
N$69  (via drill 0.51)
  Top 0.305: v79.76,39.62 IC7.4
  Bottom 0.305: v79.76,39.62 94.49,39.62 96.52,37.59 116.08,37.59 IC1.3
N$70  (via drill 0.51)
  Top 0.305: IC1.15 113.79,41.4 113.79,40.39 113.28,39.88 102.87,39.88 v102.87,46.23 | IC7.3 v70.61,46.23
  Bottom 0.305: v70.61,46.23 v102.87,46.23
N$71  (via drill 0.51)
  Top 0.305: IC9.6 35.31,35.81 v35.31,35.56
  Bottom 0.305: IC12.1 v35.31,35.56
N$72  (via drill 0.51)
  Top 0.305: v38.86,33.53 21.59,50.8 IC9.7
  Bottom 0.305: v38.86,33.53 86.87,33.53 IC12.2
N$73  (via drill 0.51)
  Top 0.305: v18.03,48.01 IC9.4
  Bottom 0.305: v18.03,48.01 28.96,37.08 85.34,37.08 85.85,37.59 89.41,37.59 IC12.3
N$74  (via drill 0.51)
  Top 0.305: v18.03,45.47 IC9.3 | v87.63,31.5 90.17,34.04 90.17,41.91 IC12.15
  Bottom 0.305: v18.03,45.47 32,31.5 v87.63,31.5
N$75  (via drill 0.51)
  Top 0.305: v128.52,40.39 127,41.91 127,50.8 IC11.6
  Bottom 0.305: IC2.1 134.87,40.39 v128.52,40.39
N$76
  Top 0.305: IC2.2 139.19,32.51 132.08,32.51 132.08,39.37 129.54,41.91 129.54,50.8 IC11.7
N$77  (via drill 0.51)
  Top 0.305: v119.63,31.5 116.84,34.29 116.84,53.34 117.6,54.1 120.65,54.1 IC11.4
  Bottom 0.305: IC2.3 140.72,31.5 v119.63,31.5
N$78  (via drill 0.51)
  Top 0.305: IC11.3 119.38,50.8 v119.38,33.78 | v133.1,33.53 142.24,42.67 IC2.15
  Bottom 0.305: v119.38,33.78 119.63,33.53 v133.1,33.53
N$79  (via drill 0.51)
  Top 0.305: v44.96,45.21 IC6.3 | v90.17,44.96 90.68,44.96 90.93,45.21 92.71,45.21 92.71,37.85 93.98,36.58 IC12.4
  Bottom 0.305: v44.96,45.21 89.92,45.21 v90.17,44.96
N$80  (via drill 0.51)
  Top 0.305: v88.14,38.61 87.12,37.59 85.6,37.59 v85.6,40.64 | IC6.6 v54.86,42.93
  Bottom 0.305: IC12.5 93.47,38.61 v88.14,38.61 | v85.6,40.64 83.31,42.93 v54.86,42.93
N$81  (via drill 0.51)
  Top 0.305: v59.44,40.89 IC6.7 | v86.61,38.61 87.38,39.37 v87.38,40.64 | v97.03,38.61 99.06,36.58 IC12.6
  Bottom 0.305: v59.44,40.89 62.48,37.85 85.09,37.85 85.85,38.61 v86.61,38.61 | v87.38,40.64 87.63,40.39 95.25,40.39 v97.03,38.61
N$82  (via drill 0.51)
  Top 0.305: v43.94,55.37 IC6.4 | v93.22,55.37 95.25,53.34 95.25,49.53 100.33,44.45 100.33,37.85 101.6,36.58 IC12.7
  Bottom 0.305: v93.22,55.37 v43.94,55.37
N$83  (via drill 0.51)
  Top 0.305: IC12.9 105.92,44.96 v105.92,46.23 | v117.86,46.23 118.11,45.97 IC1.14
  Bottom 0.305: v117.86,46.23 v105.92,46.23
N$84
  Top 0.305: IC1.9 138.43,43.18 138.43,44.45 139.19,45.21 144.78,45.21 IC2.14
N$85  (via drill 0.51)
  Top 0.305: IC1.4 121.16,36.07 121.16,39.12 121.92,39.88 121.92,61.47 v119.38,64.01 | v96.01,66.8 90.17,60.96 90.17,57.91 88.14,55.88 88.14,54.86 88.9,54.1 91.44,54.1 IC10.3
  Bottom 0.305: v119.38,64.01 116.59,66.8 v96.01,66.8
N$86  (via drill 0.51)
  Top 0.305: IC1.5 123.7,36.07 123.7,39.62 124.46,40.39 124.46,60.96 120.4,65.02 118.36,65.02 118.36,61.98 119.38,60.96 119.38,58.42 117.6,56.64 108.2,56.64 v108.2,53.09
  Bottom 0.305: v108.2,53.09 105.16,50.04 101.09,50.04 IC10.6
N$87  (via drill 0.51)
  Top 0.305: v112.78,40.89 IC10.7
  Bottom 0.305: v112.78,40.89 115.32,38.35 121.41,38.35 122.17,37.59 123.7,37.59 IC1.6
N$88  (via drill 0.51)
  Top 0.305: IC10.4 94.49,51.56 94.49,45.21 95.25,44.45 95.25,33.78 92.46,30.99 92.46,29.97 v96.27,26.16 | IC1.7 v128.27,30.48
  Bottom 0.305: v96.27,26.16 97.28,25.15 137.67,25.15 141.22,28.7 141.22,30.73 128.52,30.73 v128.27,30.48
N$89  (via drill 0.51)
  Top 0.305: IC12.14 91.95,42.67 91.95,37.59 92.71,36.83 92.71,32.26 90.17,29.72 v90.17,27.94
  Bottom 0.305: v90.17,27.94 90.42,28.19 110.74,28.19 111.25,27.69 120.4,27.69 U$10.8
N$90
  Top 0.305: IC2.4 146.05,36.83 146.05,49.78 144.78,51.05 IC8.3
N$91
  Top 0.305: IC2.5 151.13,36.83 151.13,50.8 IC8.6
N$92
  Top 0.305: IC2.6 153.67,36.83 153.67,50.8 IC8.7
N$93
  Top 0.305: IC2.7 152.91,33.53 148.59,33.53 148.59,50.8 IC8.4
N$94  (via drill 0.51)
  Top 0.305: IC12.11 99.57,42.67 99.57,37.59 100.33,36.83 100.33,34.29 101.09,33.53 102.87,33.53 102.87,36.83 103.63,37.59 114.3,37.59 114.3,31.75 U$10.10 | v124.46,32.51 124.46,36.83 125.22,37.59 125.22,42.67 IC1.11 125.73,45.97 v125.98,46.23
  Bottom 0.305: v124.46,32.51 119.13,32.51 116.84,30.23 U$10.10 | IC2.11 149.35,46.23 v125.98,46.23
N$95
  Top 0.305: U$10.9 121.92,31.75 121.92,38.86 123.19,40.13 IC1.12
  Bottom 0.305: IC12.12 98.55,45.21 121.16,45.21 | IC1.12 121.16,45.21 | IC2.12 147.83,45.21 121.16,45.21
N$96
  Top 0.305: S2.1 155.19,13.46 155.19,19.56 S2.2 | U$10.13 119.38,21.59 R9.P$2
  Bottom 0.305: R9.P$2 137.41,21.59 141.48,25.65 157.48,25.65 157.48,21.84 155.45,19.81 S2.2
N$97
  Top 0.305: R4.P$1 100.58,27.69 100.58,30.99 99.57,32 96.52,32 DS18B20.2
  Bottom 0.305: U$10.5 127,26.67 R4.P$1
N$98
  Bottom 0.305: RTC.2 101.85,18.8 112.01,18.8 112.52,19.3 128.78,19.3 130.81,17.27 U$10.A5
N$99
  Bottom 0.305: RTC.1 103.12,20.07 130.05,20.07 132.33,17.78 132.33,15.75 129.54,15.75 128.27,17.02 U$10.A4
N$100
  Bottom 1.778: S3.2 146.05,21.59 144.78,20.32 144.78,11.43 143.51,10.16 133.35,10.16 132.08,11.43 U$10.21
N$101
  Top 0.305: S1.2 155.19,29.72 155.19,23.62 S1.1 155.19,23.37 151.38,19.56 151.38,18.54 145.03,12.19 114.3,12.19 U$10.14
  Bottom 0.305: U$10.14 118.11,17.78 R8.P$2
V+
  Bottom 1.778: R1.P$2 35.56,48.26 | NIXIE_PWR_SUPPLY.HV+ 35.56,48.26 | 35.56,48.26 R7.P$2 R3.P$2 R2.P$2 R6.P$2 R5.P$2
VIN
  Bottom 2.184: IC3.IN 11.43,25.4 C1.1 11.43,13.97 15.24,10.16 19.51,10.16 J2.3 22.4,11.43 27.94,11.43 31.75,7.62 72.39,7.62 NIXIE_PWR_SUPPLY.V+

### Text on the board
_tsilk: TUBE-1 | TUBE-2 | TUBE-3 | TUBE-4 | TUBE-5 | TUBE-6 | R1 | R7 | R3 | R2 | R6 | IC_74141-DIP-16 | IC_74141-DIP-16 | IC_74141-DIP-16 | IC_74141-DIP-16 | IC_74141-DIP-16 | IC_74141-DIP-16 | IC9 | IC6 | IC7 | IC10 | IC11 | IC8 | R5 | 74LS595N | 74LS595N | 74LS595N | A15,2mm | IC12 | IC1 | IC2 | IC3 | DS18B20 | R4 | S1 | R9 | 10uF | C2 | S3 | RTC | R8 | C1 | ARDUINO_MINI | 10uF | S2 | WARNING! HIGH VOLTAGE! 170V! | SCOTT-BOT.com | NIXIE-BOT | J2